# EAGLE design Adafruit MicroLipo Charger v2 (EAGLE 9.6.2)
AUTHOR: K. TOWNSEND
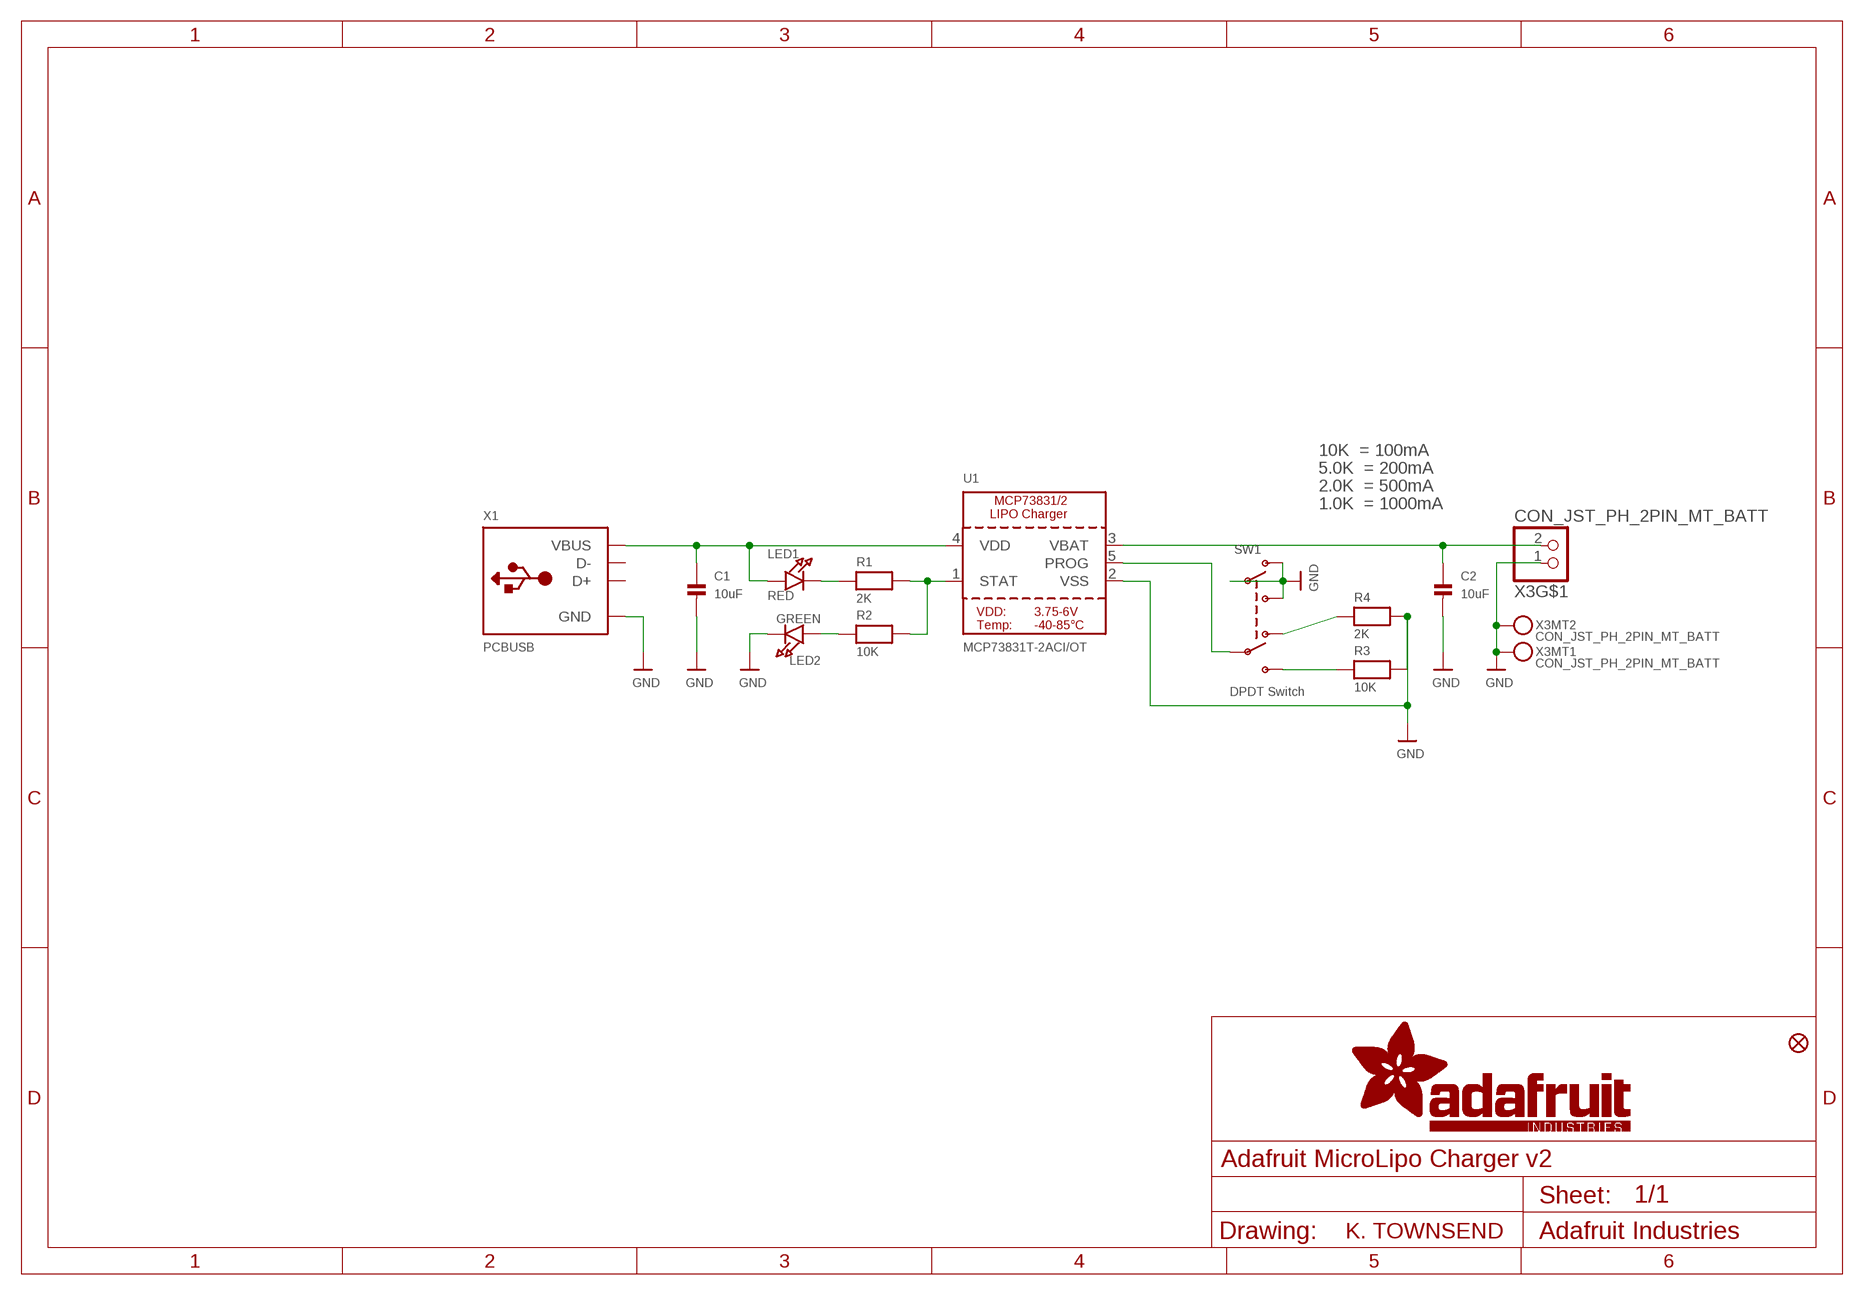
[diagram p0: schematic, sheet 1]

## Parts
C1  10uF  CAP_CERAMIC0805-NOOUTLINE  [0805-NO]
C2  10uF  CAP_CERAMIC0805-NOOUTLINE  [0805-NO]
FID1  FIDUCIAL_1MM  [FIDUCIAL_1MM]
LED1  RED  LED0603_NOOUTLINE  [CHIPLED_0603_NOOUTLINE]
LED2  GREEN  LED0603_NOOUTLINE  [CHIPLED_0603_NOOUTLINE]
R1  2K  RESISTOR_0603_NOOUT  [0603-NO]
R2  10K  RESISTOR_0603_NOOUT  [0603-NO]
R3  10K  RESISTOR_0603_NOOUT  [0603-NO]
R4  2K  RESISTOR_0603_NOOUT  [0603-NO]
SW1  DPDT Switch  SWITCH_DPDTEG1390  [EG1390]
U1  MCP73831T-2ACI/OT  MCP73831/2  [SOT23-5]
X1  PCBUSB  USB_TYPEAPCB  [USBA_PCB]
X3  CON_JST_PH_2PIN_MT_BATT  [JSTPH2_BATT]

## Nets
GND: C1.2 C2.2 LED2.C R3.2 R4.2 SW1.O1 SW1.P1 SW1.S1 U1.2(VSS) X1.GND X3.1 X3.NC1 X3.NC2
N$1: LED1.C R1.1
N$2: R1.2 R2.2 U1.1(STAT)
N$3: R3.1 SW1.S2
N$4: R4.1 SW1.O2
N$5: SW1.P2 U1.5(PROG)
N$6: LED2.A R2.1
VBAT: C2.1 U1.3(VBAT) X3.2
VDD: C1.1 LED1.A U1.4(VDD) X1.VCC(VBUS)
Unconnected: X1.USB_NEG(D-) X1.USB_PLUS(D+)

## Notes on the sheet
- 10K  = 100mA
- 5.0K  = 200mA
- 2.0K  = 500mA
- 1.0K  = 1000mA

## Library data of the parts
C1 C2 = microbuilder:CAP_CERAMIC: Ceramic Capacitors For new designs, use the packages preceded by an '_' character since they are more reliable: The following footprints should be used on most boards: _0402 - Standard footprint for regular board layouts _0603 - Standard footprint for regular board layouts _0805 - Standard footprint for regular board layouts _1206 - Standard footprint for regular board layouts For extremely tight-pitch boards where space is at a premium, the following 'micro-pitch' footprints can be used (smaller pads, no silkscreen outline, etc.): _0402MP - Micro-pitch footprint for very dense/compact boards _0603MP - Micro-pitch footprint for very dense/compact boards _0805MP - Micro-pitch footprint for very dense/compact boards _1206MP - Micro-pitch footprint for very dense/compact boards
FID1 = microbuilder:FIDUCIAL: Fiducial Alignment Points Various fiducial points for machine vision alignment.; BOM: EXCLUDE
LED1 LED2 = microbuilder:LED: LED 0603 - 0603 Surface Mount Package 2mA: Green LED - Low Power (3.9mcd, 2ma, 1.7Vf) - Digikey: 475-2709-2-ND Orange LED - Low Power (9.8mcd, 2ma, 1.8Vf) - Digikey: 475-1194-2-ND Red LED - Low Power (5mcd, 2ma, 1.8Vf) - Digikey: 475-1195-2-ND Yellow LED - Low Power (7mcd, 2ma, 1.8Vf) - Digikey: 475-1196-2-ND 5mA: Blue LED - Low Power (17mcd, 5ma, 2.9Vf) - Digikey: LNJ937W8CRACT-ND 0805 - 0805 Surface Mount Package 2mA: Red LED (8.8mcd, 2mA, 1.8Vf, Clear) - Low Power [Digikey: 475-2510-1-ND] Green LED (5mcd, 2mA, 1.8Vf, Clear) - Low Power [Digikey: 475-2730-1-ND] Yellow LED (11.3mcd, 2mA, 1.8Vf, Clear) - Low Power [Digikey: 475-2555-1-ND] 20mA: Red LED (104mcd, 20mA, Diffused) - LS R976 [Digikey: 475-1278-6-ND] Red LED (12mcd, 20mA, 2.0Vf, Clear) - APT2012EC [Digikey: 754-1128-1-ND] Green LED (15mcd, 20mA, 2.2Vf, Clear) - APT2012GC [Digikey: 754-1131-1-ND] Orange LED (160mcd, 20mA, 2.1Vf, Clear) - APT2012SECK [Digikey: 754-1130-1-ND] 1206 - 1206 Surface Mount Package Green LED (26mcd, 20mA, Diffused) - LG N971 [Digikey: 475-1407-6-ND] Red LED (15mcd, 20mA, Diffused) - LH N974 [Digikey: 475-1416-6-ND] Cree - Cree High-Power Surface Mount LEDs XPEBWT-L1-0000-00D50 - White 111lm 350mA 2.9Vf 6200K 110° XTEAWT-00-0000-00000LEE3 - White 114lm 350mA 2.85Vf 5000K 115° Everlight - Everlight 45-21 Series Surface Mount LEDs 45-21/QK2C-B2832AC2CB2/2T - Warm White 2000mcd 20mA 3.25Vf 3050K 120° 45-21/LK2C-B38452C4CB2/2T - Nuetral White 2000mcd 20mA 3.25Vf 4150K 120° 45-21/LK2C-B50634C6CB2/2T - Cold White 2200mcd 20mA 3.25Vf 5650K 120° PLCC2 Reverse Mount LS T77K-J1L2-1-0-2-R18-Z - Red 11.25mcd 2mA 1.8Vf 630nm 120° LO T77K-L1M2-24-Z - Orange 19.6mcd 2mA 1.8Vf 606nm 120° LY T77K-K2M1-26-Z - Yellow 15.7mcd 2mA 1.8Vf 587nm 120°; JLC_ROTATION: 270
R1-R4 = microbuilder:RESISTOR: Resistors For new designs, use the packages preceded by an '_' character since they are more reliable: The following footprints should be used on most boards: _0402 - Standard footprint for regular board layouts _0603 - Standard footprint for regular board layouts _0805 - Standard footprint for regular board layouts _1206 - Standard footprint for regular board layouts For extremely tight-pitch boards where space is at a premium, the following 'micro-pitch' footprints can be used (smaller pads, no silkscreen outline, etc.): _0402MP - Micro-pitch footprint for very dense/compact boards _0603MP - Micro-pitch footprint for very dense/compact boards _0805MP - Micro-pitch footprint for very dense/compact boards _1206MP - Micro-pitch footprint for very dense/compact boards
SW1 = adafruit_electromech:SWITCH_DPDT: Switch - DPDT A DPDT Switch acts like an SPDT switch, but has a pair of switches instead of just one. Vertical - 0.3A @ 6V SMT - Digikey: JS202011SCQN; LCSC: C2837066
U1 = microbuilder:MCP73831/2: MCP73831/2 LIPO Charger VDD: 3.75 - 6V Temp -40 - 85°C Programmable Charge Rate: 15-500mA NOTE: STAT is a tri-state logic output on the MCP73831 and an open-drain output on the MCP73832. SOT23-5 with 4.2V output and tri-state logic on STAT = MCP73831T-2ACI/OT; JLC_ROTATION: 270; LCSC: C424093
X1 = adafruit_electromech:USB_TYPEA: USB - Type A Connectors Male types stick out and are inserted into a PC or matching females parts (these are the connectors used on USB Memory Sticks, etc.). Female parts are generally used for USB Host and accept a male-type connector. SMT - 4UCON: 10017 PTHFML - Digikey: 609-1045-ND, 4UCon: 05241 PCB - Use 2.0mm thick PCBs with this footprint
X3 = adafruit_electromech:CON_JST_PH_2PIN_MT; LCSC: C47647

## Board
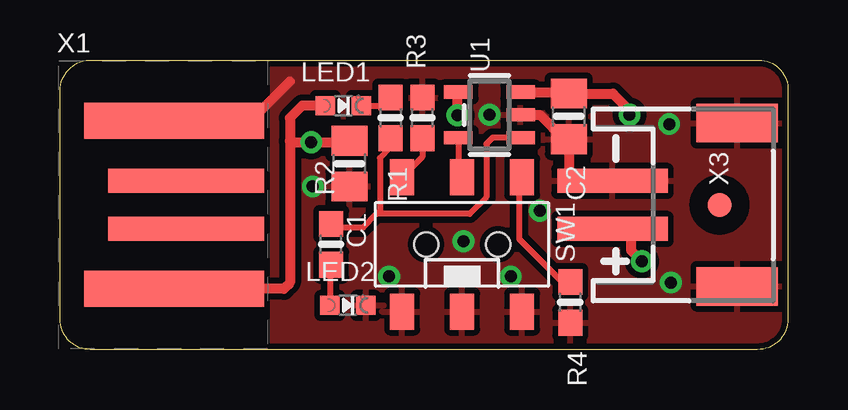
[diagram p1: board, top side]
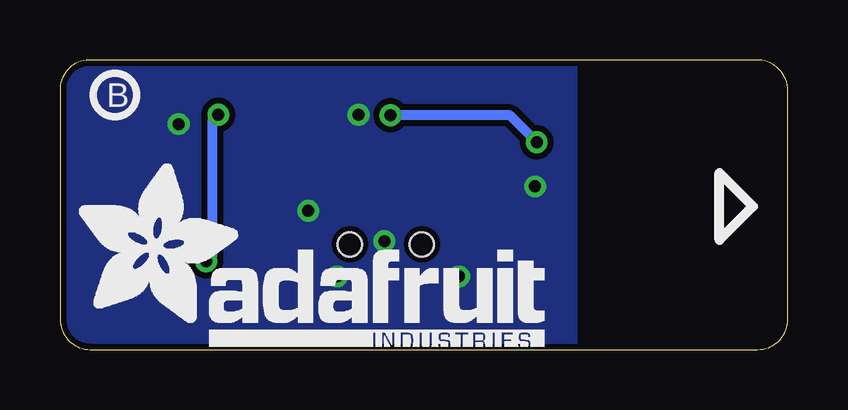
[diagram p2: board, bottom side, seen from below]

Size 30.35 x 12.06 mm. Coordinates in mm from the lower left corner, seen from the top.
Outline: 0,10.79 arc-90 1.33,12.06 29.15,12.06 arc-90 30.35,10.79 30.35,1.27 arc-90 29.08,0 1.27,0 arc-90 0,1.27 0,10.79
Copper layers (1*16): Top 0.035mm / dielectric 1.5mm / Bottom 0.035mm
Design rules "adafruit": minimum track width 8mil, minimum drill 16mil, track to track 8mil, track to pad 8mil, pad to pad 8mil, via to via 8mil, smd to smd 8mil, copper to edge 10mil, drill to drill 8mil, minimum pad ring 10mil, minimum via ring 8mil, stop-mask expansion 4mil, vias tented up to drill 20mil, thermal gap 10mil

### Footprints (pad centres in the part's own frame; a part is rotated, then mirrored left to right if it is on the bottom)
0805-NO = smd 1.24 x 1.5: 1 -0.95,0; 2 0.95,0
FIDUCIAL_1MM = smd 1 x 1: 1 0,0
CHIPLED_0603_NOOUTLINE = smd 0.8 x 0.8: A 0,-0.75; C 0,0.75
0603-NO = smd 1.075 x 1: 1 -0.85,0; 2 0.85,0
EG1390 = smd 1 x 1.5: O1 -2.5,2.8; O2 -2.5,-2.8; P1 0,2.8; P2 0,-2.8; S1 2.5,2.8; S2 2.5,-2.8 | hole 1: 1.5,0; -1.5,0
SOT23-5 = smd 0.55 x 1.2: 1 -0.95,-1.3; 2 0,-1.3; 3 0.95,-1.3; 4 0.95,1.3; 5 -0.95,1.3
USBA_PCB = smd 7.5 x 1.5: GND -0.2,3.5; VCC -0.2,-3.5 | smd 6.5 x 1: USB_NEG 0.3,-1; USB_PLUS 0.3,1
JSTPH2_BATT = smd 1 x 4.6: 1 -1,-2.049; 2 1,-2.049 | smd 1.6 x 3.4: NC1 -3.4,3.151; NC2 3.4,3.151

### Placement (x,y rotation side)
C1  12.06,7.75 270 top
C2  21.21,9.72 270 top
FID1  27.5,6.03 0 top
LED1  11.81,10.16 270 top
LED2  12,1.84 270 top
PLABEL0  [PLABEL0]  9.78,10.79 0 top
PLABEL1  [PLABEL1]  9.21,0.19 0 top
PLABEL2  [PLABEL2]  22.61,10.67 0 top
PLABEL3  [PLABEL3]  23.75,0.38 0 top
PLABEL4  [PLABEL4]  15.18,0.95 0 top
PLABEL5  [PLABEL5]  17.53,1.02 0 top
PLABEL6  [PLABEL6]  12.95,2.86 90 top
PLABEL7  [PLABEL7]  17.65,6.67 0 top
PLABEL8  [PLABEL8]  15.11,6.67 0 top
PLABEL9  [PLABEL9]  23.24,4.95 0 bottom
PLABEL10  [PLABEL10]  4,6.1 90 bottom
PLABEL11  [PLABEL11]  24.51,10.29 0 bottom
R1  13.78,9.65 270 top
R2  11.3,4.38 90 top
R3  15.11,9.65 90 top
R4  21.27,1.97 270 top
SW1  16.76,4.38 180 top
U1  17.91,9.78 90 top
U$8  [ADAFRUIT_TEXT_20MM]  29.72,0.13 0 bottom
U$9  [PCBFEAT-REV-040]  28.07,10.6 0 bottom
X1  4.95,6.03 0 top
X3  25.08,6.03 270 top

### Tracks (layer width: path | path; a pad name or v marks a point on that pad's centre or on a via)
GND  (via drill 0.5)
  Top 0.406: X1.GND 7.95,9.53 9.59,11.18 | U1.2 20,9.78 21.02,8.77 C2.2 21.21,6.8
  other vias: 17.91,9.78 10.54,6.79 25.4,9.4 25.46,2.79 13.72,3.05 18.8,3.05 16.83,4.51 20,5.78
  pour Top (isolate 0.254): 8.89,0 8.89,12.06 30.35,12.06 30.35,0
  pour Bottom (isolate 0.254): 8.89,12.06 30.35,12.06 30.35,0 8.89,0
N$1
  Top 0.254: LED1.C 13.44,10.16 R1.1
N$2
  Top 0.254: R1.2 13.78,8.42 13.34,7.98 13.34,5.78 13.21,5.65 | 13.21,5.65 12.64,5.08 11.45,5.08 R2.2 | U1.1 18.04,8.83 17.78,8.57 17.78,6.35 17.08,5.65 13.21,5.65
N$3
  Top 0.254: R3.1 15.11,8.03 SW1.S2
N$4
  Top 0.254: R4.1 20.93,2.82 19.14,4.61 19.14,7.05 SW1.O2
N$5
  Top 0.254: U1.5 16.61,7.34 SW1.P2
N$6
  Top 0.254: R2.1 11.25,3.48 LED2.A
VBAT  (via drill 0.5)
  Top 0.406: U1.3 21.14,10.73 C2.1 23.05,10.66 23.75,9.97 v23.75,9.78 | v24.26,3.68 23.81,4.13 23.81,4.89 23.67,5.03 X3.2
  Bottom 0.406: v23.75,9.78 24,9.53 24,3.94 v24.26,3.68
VDD  (via drill 0.5)
  Top 0.406: X1.VCC 9.33,2.53 9.59,2.79 9.59,8.7 | LED1.A 10.1,10.16 9.59,9.65 9.59,8.7 | C1.1 12,8.64 v10.48,8.64 9.65,8.64 9.59,8.7 | v16.57,9.76 16.57,10.7 U1.4
  Bottom 0.406: v10.48,8.64 11.6,9.76 v16.57,9.76

### Text on the board
Pinguin_tBackup: CHG | MicroLipo | 1 | 5 | Rate | L | H | DONE | 3.7/4.2V
Pinguin_bBackup: Adafruit MicroLipo | Plug into USB | 3.7V/4.2V LiPoly/LiIon / 100mA/500mA Rate / Battery Charger